# EAGLE board avocado_v2.0 (EAGLE 8.6.0)
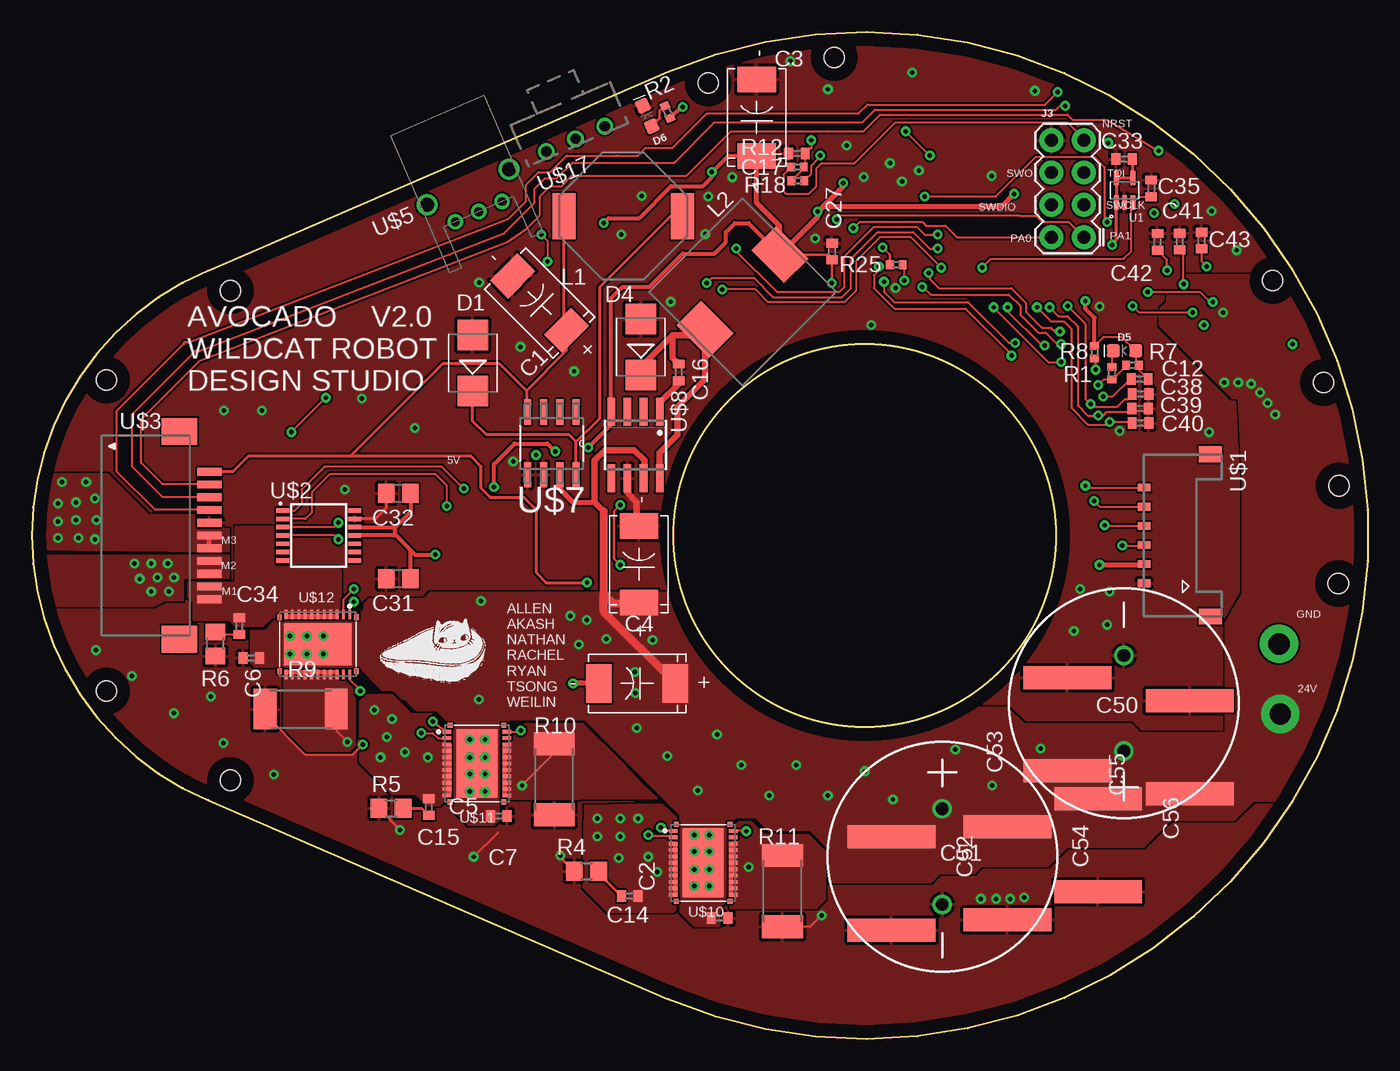
[diagram p2: board, top side]
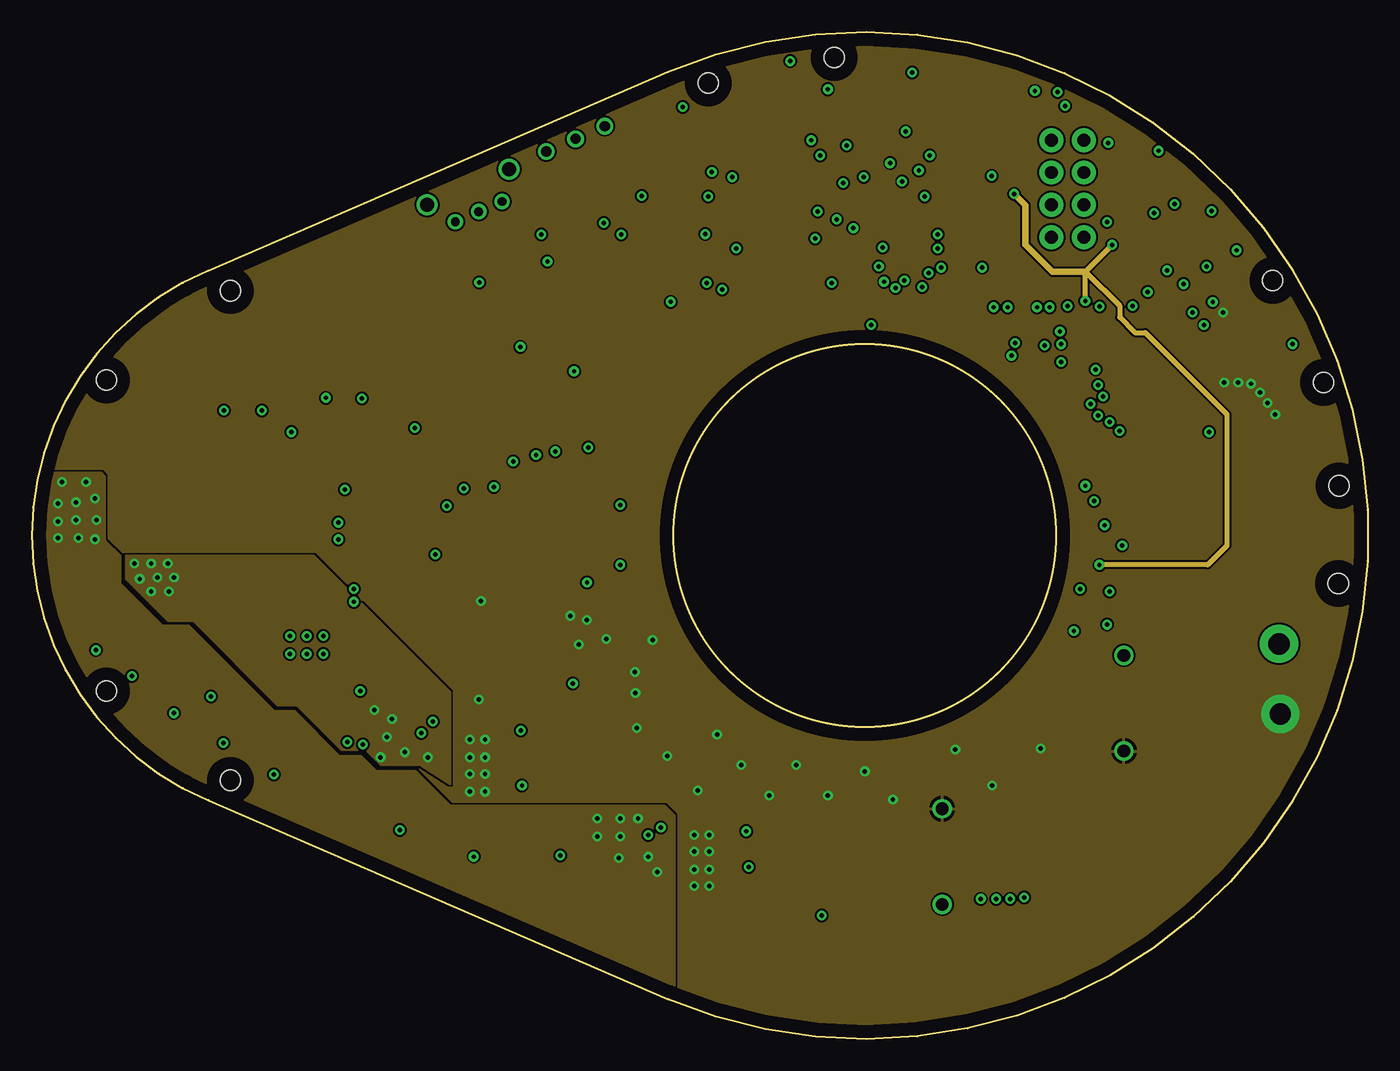
[diagram p3: board, inner layer Route2]
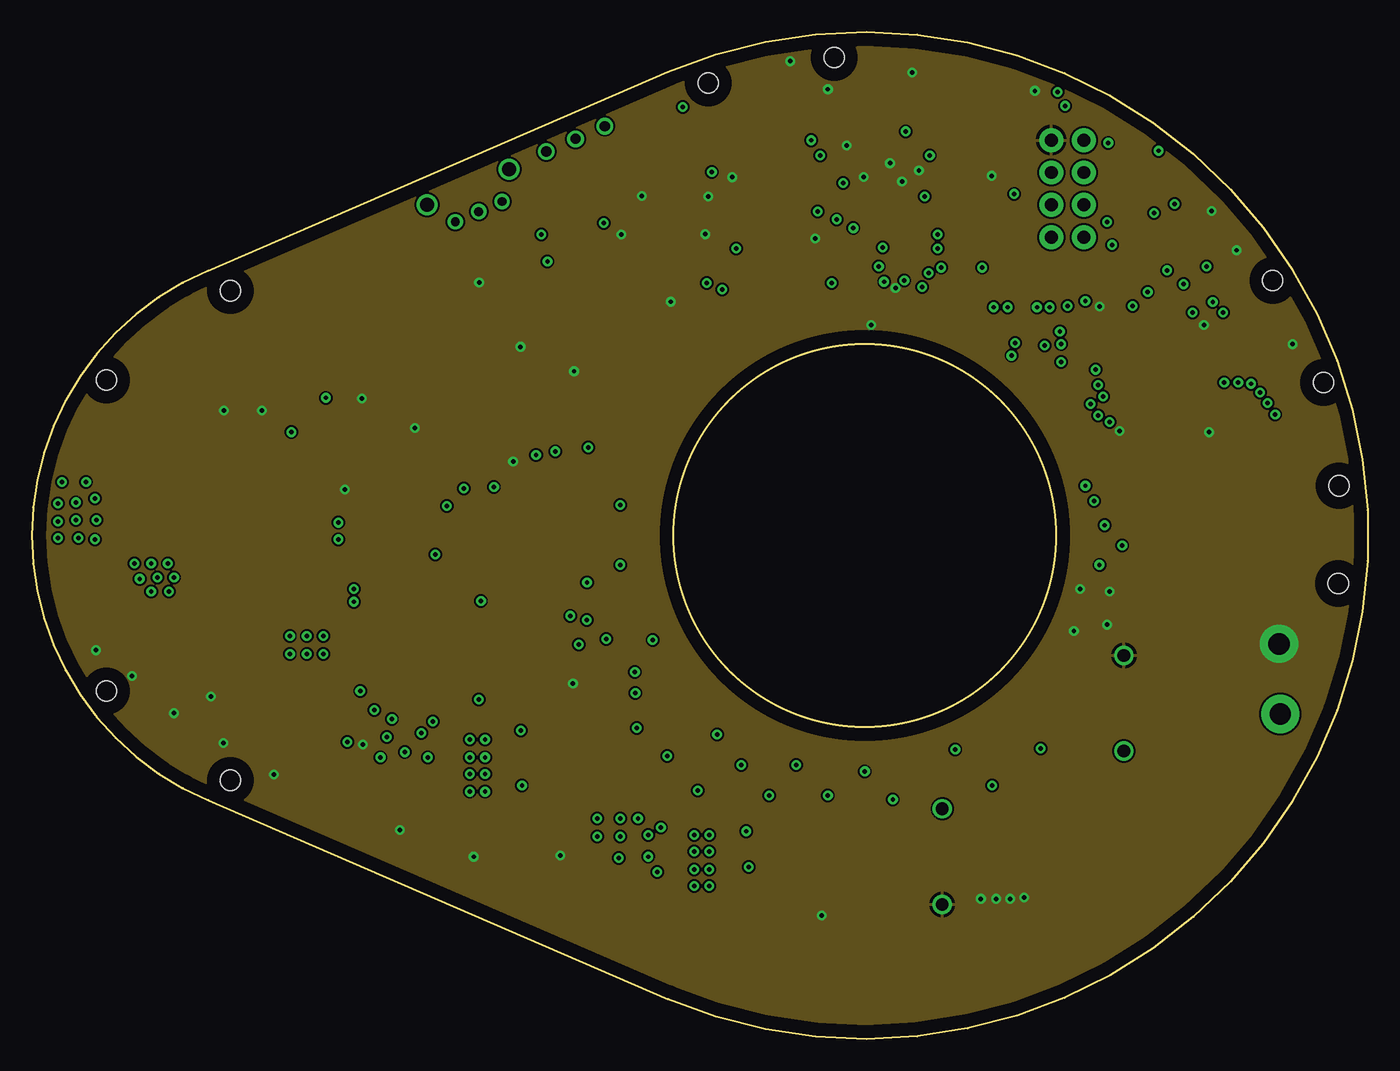
[diagram p4: board, inner layer Route15]
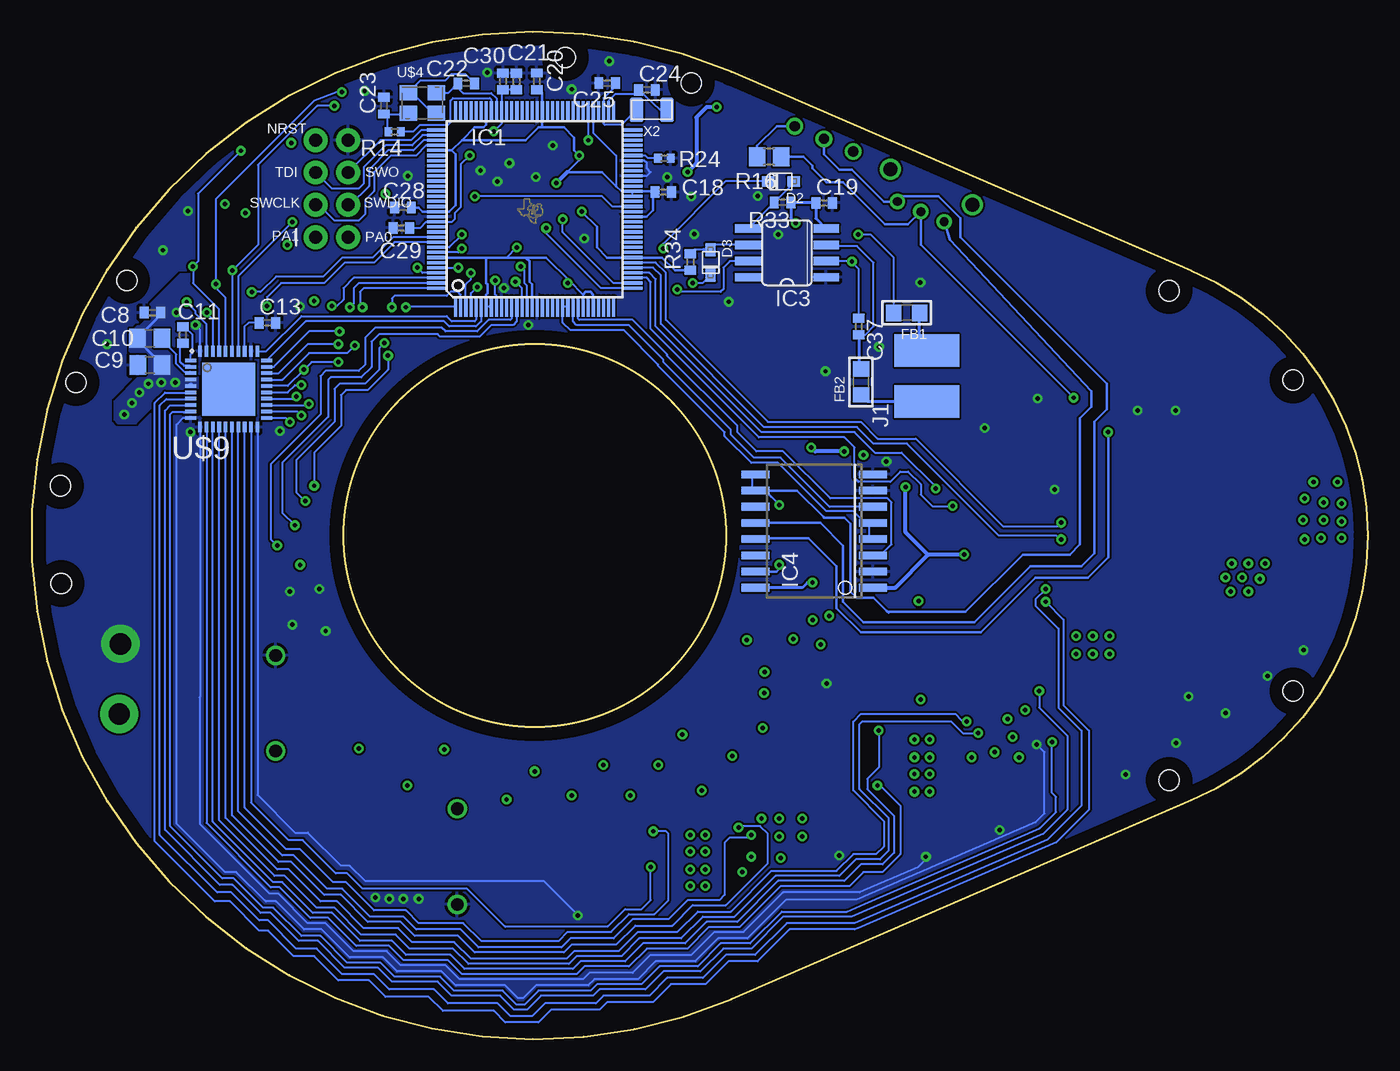
[diagram p5: board, bottom side, seen from below]

Size 104.81 x 79 mm. Coordinates in mm from the lower left corner, seen from the top.
Outline: 49.93,75.86 arc-226 49.93,3.14 13.84,18.73 arc-135 13.84,60.27 49.93,75.86
Outline: circle at 65.36,39.5 radius 15
Copper layers ((1*2)+(15*16)): Top 0.07mm / dielectric 0.36mm / Route2 0.0525mm / dielectric 0.71mm / Route15 0.0525mm / dielectric 0.36mm / Bottom 0.07mm
Design rules "default *": minimum track width 6mil, minimum drill 0.35mm, track to track 6mil, track to pad 6mil, pad to pad 6mil, via to via 6mil, smd to smd 6mil, copper to edge 40mil, drill to drill 6mil, minimum pad ring 10mil, minimum via ring 8mil, stop-mask expansion 4mil, vias tented up to drill 0mil, thermal gap 10mil
Holes 1.6 mm at 101.36,51.5 97.36,59.5 62.96,77 53.06,75 102.56,43.4 102.5,35.74 15.58,20.3 5.84,27.3 15.58,58.7 5.84,51.7

## Footprints (pad centres in the part's own frame; a part is rotated, then mirrored left to right if it is on the bottom)
2917-D = smd 2 x 3: + 3,0; - -3,0
C0402 = smd 0.7 x 0.9: 1 -0.65,0; 2 0.65,0
C0805 = smd 1.3 x 1.5: 1 -0.95,0; 2 0.95,0
UPJXXXXXMHD6 = drill 1: + -3.75,0; - 3.75,0
3025 = smd 1.8 x 6.9: P$1 -3.65,0; P$2 3.65,0
SMB = smd 2.4 x 2.4: A 2.2,0; C -2.2,0
SOD-323F = smd 1 x 0.8: A -1,0; C 1,0
LED-0603 = smd 1 x 1: A -0.877,0; C 0.877,0
_0805 = smd 1.2 x 1.3: 1 -1.016,0; 2 1.016,0
PDT_S-PQFP-G128 = smd 0.245 x 1.6: 1 -6.2,-7.65; 2 -5.8,-7.65; 3 -5.4,-7.65; 4 -5,-7.65; 5 -4.6,-7.65; 6 -4.2,-7.65; 7 -3.8,-7.65; 8 -3.4,-7.65; 9 -3,-7.65; 10 -2.6,-7.65; 11 -2.2,-7.65; 12 -1.8,-7.65; 13 -1.4,-7.65; 14 -1,-7.65; 15 -0.6,-7.65; 16 -0.2,-7.65; 17 0.2,-7.65; 18 0.6,-7.65; 19 1,-7.65; 20 1.4,-7.65; 21 1.8,-7.65; 22 2.2,-7.65; 23 2.6,-7.65; 24 3,-7.65; 25 3.4,-7.65; 26 3.8,-7.65; 27 4.2,-7.65; 28 4.6,-7.65; 29 5,-7.65; 30 5.4,-7.65; 31 5.8,-7.65; 32 6.2,-7.65; 65 6.2,7.65; 66 5.8,7.65; 67 5.4,7.65; 68 5,7.65; 69 4.6,7.65; 70 4.2,7.65; 71 3.8,7.65; 72 3.4,7.65; 73 3,7.65; 74 2.6,7.65; 75 2.2,7.65; 76 1.8,7.65; 77 1.4,7.65; 78 1,7.65; 79 0.6,7.65; 80 0.2,7.65; 81 -0.2,7.65; 82 -0.6,7.65; 83 -1,7.65; 84 -1.4,7.65; 85 -1.8,7.65; 86 -2.2,7.65; 87 -2.6,7.65; 88 -3,7.65; 89 -3.4,7.65; 90 -3.8,7.65; 91 -4.2,7.65; 92 -4.6,7.65; 93 -5,7.65; 94 -5.4,7.65; 95 -5.8,7.65; 96 -6.2,7.65 | smd 1.6 x 0.245: 33 7.65,-6.2; 34 7.65,-5.8; 35 7.65,-5.4; 36 7.65,-5; 37 7.65,-4.6; 38 7.65,-4.2; 39 7.65,-3.8; 40 7.65,-3.4; 41 7.65,-3; 42 7.65,-2.6; 43 7.65,-2.2; 44 7.65,-1.8; 45 7.65,-1.4; 46 7.65,-1; 47 7.65,-0.6; 48 7.65,-0.2; 49 7.65,0.2; 50 7.65,0.6; 51 7.65,1; 52 7.65,1.4; 53 7.65,1.8; 54 7.65,2.2; 55 7.65,2.6; 56 7.65,3; 57 7.65,3.4; 58 7.65,3.8; 59 7.65,4.2; 60 7.65,4.6; 61 7.65,5; 62 7.65,5.4; 63 7.65,5.8; 64 7.65,6.2; 97 -7.65,6.2; 98 -7.65,5.8; 99 -7.65,5.4; 100 -7.65,5; 101 -7.65,4.6; 102 -7.65,4.2; 103 -7.65,3.8; 104 -7.65,3.4; 105 -7.65,3; 106 -7.65,2.6; 107 -7.65,2.2; 108 -7.65,1.8; 109 -7.65,1.4; 110 -7.65,1; 111 -7.65,0.6; 112 -7.65,0.2; 113 -7.65,-0.2; 114 -7.65,-0.6; 115 -7.65,-1; 116 -7.65,-1.4; 117 -7.65,-1.8; 118 -7.65,-2.2; 119 -7.65,-2.6; 120 -7.65,-3; 121 -7.65,-3.4; 122 -7.65,-3.8; 123 -7.65,-4.2; 124 -7.65,-4.6; 125 -7.65,-5; 126 -7.65,-5.4; 127 -7.65,-5.8; 128 -7.65,-6.2
SO08 = smd 0.66 x 2.032: 1 -1.905,-3.073; 2 -0.635,-3.073; 3 0.635,-3.073; 4 1.905,-3.073; 5 1.905,3.073; 6 0.635,3.073; 7 -0.635,3.073; 8 -1.905,3.073
SOIC16 = smd 0.6 x 2.2: 1 -4.445,-4.6; 2 -3.175,-4.6; 3 -1.905,-4.6; 4 -0.635,-4.6; 5 0.635,-4.6; 6 1.905,-4.6; 7 3.175,-4.6; 8 4.445,-4.6; 9 4.445,4.6; 10 3.175,4.6; 11 1.905,4.6; 12 0.635,4.6; 13 -0.635,4.6; 14 -1.905,4.6; 15 -3.175,4.6; 16 -4.445,4.6
2_SMP = smd 2.54 x 5.08: 1 -2,0; 2 2,0
2X4 = drill 1.016 pad 1.88: 1 -3.81,-1.27; 2 -3.81,1.27; 3 -1.27,-1.27; 4 -1.27,1.27; 5 1.27,-1.27; 6 1.27,1.27; 7 3.81,-1.27; 8 3.81,1.27
SRU1028 = smd 1.8 x 3.6: 1 -4.65,0; 2 4.65,0
B82464G4473M000 = smd 2.7 x 3.6: 1 -4.15,0; 2 4.15,0
R0402 = smd 0.6 x 0.7: 1 -0.5,0; 2 0.5,0
R0805 = smd 1.3 x 1.5: 1 -0.95,0; 2 0.95,0
R2512 = smd 1.8 x 3.2: 1 -2.8,0; 2 2.8,0
R0402' = smd 0.7 x 0.9: 1 -0.65,0; 2 0.65,0
SOT65P210X110-5N = smd 1.19 x 0.4: 1 -0.96,0.65; 2 -0.96,0; 3 -0.96,-0.65; 4 0.96,-0.65; 5 0.96,0.65
5040500691 = smd 0.6 x 1: 1 3.75,0; 2 2.25,0; 3 0.75,0; 4 -0.75,0; 5 -2.25,0; 6 -3.75,0 | smd 1.25 x 1.8: P$7 6.355,5.19; P$8 -6.355,5.19
SOP65P640X120-14N = smd 1 x 0.35: 1 -2.825,1.95; 2 -2.825,1.3; 3 -2.825,0.65; 4 -2.825,0; 5 -2.825,-0.65; 6 -2.825,-1.3; 7 -2.825,-1.95; 8 2.825,-1.95; 9 2.825,-1.3; 10 2.825,-0.65; 11 2.825,0; 12 2.825,0.65; 13 2.825,1.3; 14 2.825,1.95
1MM-FPC-11PIN = smd 0.6 x 1.9: 1 -5,3.25; 2 -4,3.25; 3 -3,3.25; 4 -2,3.25; 5 -1,3.25; 6 0,3.25; 7 1,3.25; 8 2,3.25; 9 3,3.25; 10 4,3.25; 11 5,3.25 | smd 2.1 x 2.8: THERMPAD 8.15,0.9; THERMPAD1 -8.15,0.9
NX3225GA = smd 1.4 x 1.2: P$1 1.1,0.8; P$2 -1.1,0.8; P$3 -1.1,-0.8; P$4 1.1,-0.8
S03B-PASK-2 = drill 0.7: 1 2,0; 2 0,0; 3 -2,0 | drill 1.1: P$4 -3.5,2.1; P$5 3.5,2.1
SOIC127P620X175-8N = smd 1.981 x 0.559: 1 -2.464,1.905; 2 -2.464,0.635; 3 -2.464,-0.635; 4 -2.464,-1.905; 5 2.464,-1.905; 6 2.464,-0.635; 7 2.464,0.635; 8 2.464,1.905
SO08' = smd 0.6 x 2.2: 1 -1.905,-2.6; 2 -0.635,-2.6; 3 0.635,-2.6; 4 1.905,-2.6; 5 1.905,2.6; 6 0.635,2.6; 7 -0.635,2.6; 8 -1.905,2.6
DRV8323S = smd 0.28 x 0.85: AGND 1.75,2.975; CAL 2.25,2.975; DVDD 1.25,2.975; GHB -0.25,-2.975; GHC 0.25,-2.975; GLB -1.25,-2.975; GLC 1.25,-2.975; INHA 0.75,2.975; INHB -0.25,2.975; INHC -1.25,2.975; INLA 0.25,2.975; INLB -0.75,2.975; INLC -1.75,2.975; PGND -2.25,2.975; SHB -0.75,-2.975; SHC 0.75,-2.975; SNB -2.25,-2.975; SNC 2.25,-2.975; SPB -1.75,-2.975; SPC 1.75,-2.975 | smd 0.85 x 0.28: CPH -2.975,1.75; CPL -2.975,2.25; ENABLE 2.975,2.25; GHA -2.975,-0.25; GLA -2.975,-1.25; N_FAULT 2.975,-0.25; N_SCS 2.975,1.75; SCLK 2.975,1.25; SDI 2.975,0.75; SDO 2.975,0.25; SHA -2.975,-0.75; SNA -2.975,-2.25; SOA 2.975,-1.25; SOB 2.975,-1.75; SOC 2.975,-2.25; SPA -2.975,-1.75; VCP -2.975,1.25; VDRAIN -2.975,0.25; VM -2.975,0.75; VREF 2.975,-0.75 | smd 4.15 x 4.15: P$41 0,0
MOSFET_CSD88599Q5DC = smd 0.7 x 0.25: 1 -2.35,2.5; 2 -2.35,2; 3 -2.35,1.5; 4 -2.35,1; 5 -2.35,0.5; 6 -2.35,0; 7 -2.35,-0.5; 8 -2.35,-1; 9 -2.35,-1.5; 10 -2.35,-2; 11 -2.35,-2.5; 12 2.35,-2.5; 13 2.35,-2; 14 2.35,-1.5; 15 2.35,-1; 16 2.35,-0.5; 17 2.35,0; 18 2.35,0.5; 19 2.35,1; 20 2.35,1.5; 21 2.35,2; 22 2.35,2.5 | smd 0.43 x 0.375: 23 -2.115,3.013; 24 -2.115,-3.013; 25 2.115,-3.013; 26 2.115,3.013 | smd 3.3 x 5.4: 27 0,0
MHSS1105 = drill 0.8: 1 -2.5,0; 2 2.5,0; COM 0,0
ABRACON-ABS07-32.768KHZ = smd 1.1 x 1.9: P$1 -1.2,0; P$2 1.2,0

## Placement (x,y rotation side)
C1  100u  [2917-D]  39.84,57.73 315 top
C2  15u  [2917-D]  47.5,27.9 0 top
C3  100u  [2917-D]  56.87,72.28 270 top
C4  15u  [2917-D]  47.63,37.25 270 top
C5  10nF  [C0402]  36.64,17.49 0 top
C6  10nF  [C0402]  17.22,29.89 180 top
C7  10nF  [C0402]  53.96,9.49 0 top
C8  0.1uF  [C0402]  95.34,56.97 180 bottom
C9  10uF  [C0805]  95.55,52.87 180 bottom
C10  1uF  [C0805]  95.56,54.98 0 bottom
C11  0.047uF  [C0402]  92.97,55.23 90 bottom
C12  0.1uF  [C0402]  86.93,51.77 180 top
C13  1uF  [C0402]  86.34,56.18 0 bottom
C14  4.7nF  [C0402]  46.9,11.22 180 top
C15  4.7nF  [C0402]  31.14,18.19 270 top
C16  0.01uF  [C0402]  50.76,52.3 90 top
C17  0.1uF  [C0402]  60.03,69.47 180 top
C18  0.1uF  [C0402]  55.28,66.43 0 bottom
C19  10uF  [C0402]  42.64,65.58 0 bottom
C20  0.1uF  [C0402]  65.2,75.12 90 bottom
C21  0.1uF  [C0402]  66.79,75.11 90 bottom
C22  12pF  [C0402]  70.74,74.96 0 bottom
C23  12pF  [C0402]  77.18,73.21 90 bottom
C24  12pF  [C0402]  56.54,74.46 0 bottom
C25  12pF  [C0402]  59.68,74.97 180 bottom
C27  0.1uF  [C0402]  62.78,61.77 90 top
C28  0.1uF  [C0402]  75.68,65.22 180 bottom
C29  0.1uF  [C0402]  75.83,63.62 180 bottom
C30  2.2uF  [C0402]  67.84,75.12 90 bottom
C31  1uF  [C0805]  28.76,36.1 180 top
C32  1uF  [C0805]  28.76,42.8 180 top
C33  0.1uF  [C0402]  85.69,69.02 180 top
C34  4.7nF  [C0402]  16.29,32.38 270 top
C35  0.01uF  [C0402]  87.83,66.73 90 top
C37  0.01uF  [C0402]  39.93,55.89 270 bottom
C38  2200pF  [C0402]  86.98,50.59 0 top
C39  2200pF  [C0402]  86.95,49.45 0 top
C40  2200pF  [C0402]  86.98,48.31 0 top
C41  1000pF  [C0402]  90.06,62.55 90 top
C42  1000pF  [C0402]  88.32,62.54 90 top
C43  1000pF  [C0402]  91.77,62.63 90 top
C50  UPJXXXXXMHD6  [UPJXXXXXMHD6]  85.69,26.34 90 top
C51  UPJXXXXXMHD6  [UPJXXXXXMHD6]  71.43,14.31 270 top
C52  C7563  [3025]  67.46,12.2 270 top
C53  C7563  [3025]  81.26,24.7 90 top
C54  C7563  [3025]  76.56,13 270 top
C55  C7563  [3025]  90.86,22.9 90 top
C56  C7563  [3025]  83.66,15.2 270 top
D1  MBRS130LT3  [SMB]  34.59,53.03 90 top
D2  1n4148  [SOD-323F]  46.03,67.27 180 bottom
D3  1N4148  [SOD-323F]  51.56,60.91 270 bottom
D4  MBRS130LT3  [SMB]  47.78,54.27 90 top
D5  RED  [LED-0603]  85.73,53.99 180 top
D6  GREEN  [LED-0603]  48.29,72.4 113.4 top
FB1  Ferrite  [_0805]  36.17,56.96 180 bottom
FB2  Ferrite  [_0805]  39.75,51.55 90 bottom
IC1  TM4C129XXXPDT  [PDT_S-PQFP-G128]  65.36,65.1 0 bottom
IC3  MAX31855  [SO08]  45.56,61.66 90 bottom
IC4  ISO3088  [SOIC16]  43.42,39.84 90 bottom
J1  THERMOCOUPLE  [2_SMP]  34.59,51.99 90 bottom
J3  [2X4]  81.26,66.7 90 top
L1  SRU1028  [SRU1028]  46.39,64.55 180 top
L2  B82464G4473M000  [B82464G4473M000]  55.76,58.6 45 top
R1  330  [R0402]  84.74,52.22 270 top
R2  330  [R0402]  49.87,72.71 113.4 top
R4  2.21  [R0805]  43.51,13.16 0 top
R5  2.21  [R0805]  28.18,18.1 0 top
R6  2.21  [R0805]  14.4,30.99 90 top
R7  10K  [R0402]  86.36,52.85 0 top
R8  1.5K  [R0402]  83.38,53.87 90 top
R9  0.014  [R2512]  21.09,25.88 0 top
R10  0.014  [R2512]  41,20.38 90 top
R11  0.014  [R2512]  58.9,11.6 90 top
R12  10K  [R0402]  60.06,68.4 0 top
R14  2K  [R0402]  76.35,71.17 180 bottom
R16  120  [R0805]  46.96,69.2 180 bottom
R18  10K  [R0402]  60.1,67.33 0 top
R24  4.87K 1%  [R0402]  55.18,69.09 180 bottom
R25  [R0402]  67.83,60.74 180 top
R33  10K  [R0402']  45.91,65.63 180 bottom
R34  10K  [R0402']  53.14,60.95 90 bottom
U1  LMT87DCKT  [SOT65P210X110-5N]  85.74,66.58 90 top
U$1  5040500691  [5040500691]  87.26,39.5 270 top
U$2  AS5048A-HTSP-500  [SOP65P640X120-14N]  22.5,39.5 0 top
U$3  EC45FLAT_BLDC  [1MM-FPC-11PIN]  10.68,39.5 270 top
U$4  NX3225GA  [NX3225GA]  74.18,73.42 0 bottom
U$5  S03B-PASK-2  [S03B-PASK-2]  35.06,64.9 23.4 top
U$7  LM2594M-5.0  [SOIC127P620X175-8N]  40.79,46.72 270 top
U$8  LM2675M  [SO08']  47.36,46.6 180 top
U$9  DRV8323SHOMEMADE  [DRV8323S]  89.36,50.98 0 bottom
U$10  CSD88584Q5DC  [MOSFET_CSD88599Q5DC]  52.67,13.82 0 top
U$11  CSD88584Q5DC  [MOSFET_CSD88599Q5DC]  34.93,21.61 0 top
U$12  CSD88584Q5DC  [MOSFET_CSD88599Q5DC]  22.45,30.96 270 top
U$17  MHSS1105  [MHSS1105]  42.66,70.61 23.4 top
X2  [ABRACON-ABS07-32.768KHZ]  56.17,72.88 180 bottom

## Tracks (layer width: path | path; a pad name or v marks a point on that pad's centre or on a via)
3V3DC  (via drill 0.35)
  Top 0.152: C33.1 86.39,68.98 | v61.66,64.9 61.76,65 | C12.1 86.86,52.49 86.86,52.7 | 86.86,52.7 R7.2 | v61.86,69.3 61.16,68.5 61.16,67.89 R18.2 | R8.2 84.11,55.1 85.5,55.1 D5.A 86.61,52.95 86.86,52.7 | 28.41,40.15 28.46,40.1
  Top 0.203: R25.2 67.33,61.53 v66.76,62.1 | 62.56,60.9 C27.1 | C27.1 62.78,59.32 v62.77,59.31 | 59.66,61.53 62.37,61.53 C27.1
  Top 0.254: 86.39,68.98 U1.4 U1.5 U1.1 85.09,62.62 v84.76,62.3 | 45.53,48.27 45.53,48.5 45.53,49.07 | 61.5,65.06 v61.66,64.9 | 62.06,65.3 61.76,65 | 63.66,66.9 v63.66,67.14 | 87.21,37.2 U$1.2 | 28.56,39.5 28.36,39.5 28.46,39.6 | v53.36,68 53.36,67.6
  Top 0.305: v43.66,46.4 45.53,48.27 | v44.86,64 45.26,64.4 47.66,64.4 50.16,66.9 52.66,66.9 53.36,67.6 | R8.2 83.38,56.58 82.66,57.3 v82.66,57.9 | v41.06,46.1 40.46,46.7 37.86,46.7 36.26,45.1 v36.26,43.3 | C32.1 29.71,41.35 28.46,40.1 28.46,39.6 | U$2.12 28.41,40.15 | C31.1 29.71,38.35 | 29.71,38.35 28.56,39.5 | 28.36,39.5 U$2.11 | 29.71,38.35 30.06,38 v31.66,38 | R2.1 50.92,73.1 v51.06,73.1 | 45.53,48.5 45.53,49.13 U$8.4 45.46,58.09 46.36,59 48.46,59 51.06,61.6 53.56,61.6 54.46,62.5 54.46,63.3 55.16,64 56.23,64 L2.2 59.66,61.53 | v53.36,68 54.64,69.28 C3.+
  Top 0.406: v77.06,66.3 76.06,65.3 62.06,65.3 | 63.66,66.9 v61.66,64.9 61.66,64.5 L2.2 58.7,63.77 56.87,65.59 C3.+ | v83.76,37.2 87.21,37.2
  Route2 0.152: 77.26,66.5 v77.06,66.3
  Route2 0.406: 82.66,60.2 v84.76,62.3 | v82.66,57.9 82.66,60.2 | 82.66,60.2 85.36,57.5 85.36,56.6 86.56,55.4 87.36,55.4 93.76,49 93.76,38.7 92.26,37.2 v83.76,37.2
  Route2 0.508: v77.06,66.3 77.96,65.4 77.96,62.3 80.06,60.2 82.66,60.2
  Bottom 0.152: C20.1 64.76,74.24 | 73.03,64.92 IC1.113 | 38.39,35.54 39,35.54 IC4.1 38.39,35.54 | 38.39,35.54 38.26,35.41 38.26,35.51 | 57.59,61.29 IC1.39 | IC1.47 57.59,64.49 | 56.22,66.47 56.05,66.45 C18.1 | IC1.8 68.87,57.48 69.17,57.48 IC1.7 | 72.98,61.29 IC1.122 | 61.55,58.4 61.55,57.48 IC1.26 | IC1.69 60.76,71.1 58.96,69.3 58.96,66.9 58.56,66.5 IC1.52 | 66.06,61.3 66.07,61.29 | 43.36,46.1 v43.66,46.4 | 64.76,71.9 IC1.79 | IC1.52 IC1.51 | IC1.52 57.64,66.43 | 43.04,65.63 C19.1 | 69.06,59.2 69.16,59.3
  Bottom 0.2: 60.96,58.6 60.76,58.4 IC1.28
  Bottom 0.203: 64.76,74.24 IC1.79 64.76,71.5 | 71.86,69.7 71.56,69.4 71.56,65.4 72.06,64.9 IC1.113 74.16,64.9 74.48,65.22 C28.1 | IC1.101 71.86,69.7 | 71.86,69.7 71.06,70.5 | 71.06,70.5 70.06,71.5 69.36,71.5 69.16,71.7 IC1.90 | 69.17,57.48 69.17,58.4 69.06,58.51 69.06,59.2 | 62.62,59.46 61.55,58.4 61.35,58.6 60.96,58.6 | 62.62,59.46 v62.77,59.31 | IC1.16 65.56,59.2 65.76,59.4 65.76,61 66.06,61.3 64.45,61.3 62.62,59.46 | 67.57,61.29 69.16,61.29 | 69.16,61.29 72.98,61.29 | 66.07,61.29 67.57,61.29 | 58.96,66.9 60.06,68 62.8,68 61.86,68.94 v61.86,69.3 62.26,69.7 62.26,70.7 63.06,71.5 64.76,71.5 | 64.76,71.5 65.06,71.5 66.06,70.5 71.06,70.5 | v66.76,62.1 67.57,61.29 | R34.1 54.36,60.3 55.36,61.3 IC1.39 59.66,61.3 60.46,62.1 60.46,63.7 v61.66,64.9 | 69.16,59.3 69.16,61.29 | 57.59,64.49 56.57,64.49 56.05,65.01 56.05,66.31 | 56.05,66.31 56.05,66.45 | IC1.52 56,66.5 C18.1 56.05,66.31
  Bottom 0.254: 43.04,65.63 R33.1 45.26,64.4 v44.86,64 | IC4.1 38.56,35.4 38.56,35.26 | 34.46,38 34.49,37.98 | C19.1 43.29,64.37 IC3.4
  Bottom 0.305: v41.06,46.1 43.36,46.1 | 38.56,35.4 37.06,35.4 34.49,37.98 36.26,39.75 v36.26,43.3 | 62.8,68 v63.66,67.14 | v31.66,38 34.46,38 | v51.06,73.1 51.86,73.1 52.66,72.3 52.66,68.7 v53.36,68
5VDC  (via drill 0.35)
  Top 0.152: 42.35,65.86 L1.2 42.5,65.71 | 38.84,49.25 U$7.4
  Top 0.254: v43.56,35.8 40.36,35.8 39.56,36.6 39.56,41.5 38.56,42.5 35.96,42.5 35.26,43.2 35.26,44.9 34.46,45.7 24.96,45.7 | 38.84,49.25 38.8,49.3 38.8,50.86 | 24.96,45.7 16.96,45.7 15.76,44.5 U$3.1 | 24.96,45.7 32.26,53 36.66,53 38.8,50.86 | L1.2 41.74,56.23 C1.+ 41.96,54.03 38.8,50.86
  Bottom 0.254: v43.56,35.8 43.96,35.8 44.36,35.4 IC4.16
24VDC  (via drill 0.35, 1.68 pad 3)
  Top 0.152: 41.44,44.38 U$7.7 41.44,44.22 | 47.53,34.17 C4.+
  Top 0.305: 41.44,43.43 41.44,44.22
  Top 0.406: U$7.7 41.43,43.13 42.46,42.1 44.16,42.1 | 48.07,44.03 U$8.7
  Top 0.508: 44.86,41.4 44.16,42.1 44.16,45.4 44.96,46.2 47.26,46.2 48.07,45.4 48.07,44.03
  Top 0.61: 44.86,41.4 44.86,34.9 | 44.86,34.9 45.6,34.17 47.53,34.17 | C2.+ 44.86,33.53 44.86,34.9
  Bottom 0.152: 92.26,51.28 U$9.VDRAIN 92.41,51.28 | 94.39,52.81 C9.1 94.54,52.96 | 96.22,54.94 96.22,54.64 | 96.37,54.94 96.45,54.96 C10.1
  Bottom 0.254: C9.1 96.22,54.59 96.22,54.64 | C10.1 96.37,55.12 | 96.37,55.12 94.69,56.8 C8.1 | 96.37,55.12 96.37,55.1 | 96.37,55.1 96.37,54.94 | C10.1 96.49,54.98 96.37,55.1 | C10.1 96.46,54.98 96.45,54.96 | 96.37,54.94 96.47,54.94 C10.1 | 96.37,54.94 96.22,54.94
  Bottom 0.305: 92.34,51.35 92.41,51.28
  other vias: 35.56,19.4 35.56,20.8 35.56,22.1 34.36,19.4 34.36,20.8 34.36,22.1 51.96,13.3 51.96,14.7 51.96,16 53.16,13.3 53.16,14.7 93.56,51.5 94.66,51.5 95.66,51.4 96.36,50.7 96.96,49.9 97.56,49 93.46,57 53.16,16 34.36,23.5 35.56,23.5 51.96,12 53.16,12 20.26,31.6 20.26,30.2 21.56,30.2 22.86,30.2 22.86,31.6 21.56,31.6 97.96,25.5 49.86,22.2 53.76,23.9 52.26,19.5 55.66,21.5 57.86,19.1 59.96,21.5 62.46,19.1 65.36,21 67.56,18.8 72.46,22.7 75.36,19.9 79.16,22.8 35.06,26.62 35.24,34.36 43.54,32.86 45.06,31.38 42.92,30.96 47.32,28.78 47.36,27.14 47.46,24.4 48.7,31.3 42.24,33.2
  pour Route2 (rank 3): -4.14,82.4 -4.14,-1.6 113.26,-1.5 113.36,-1.6 113.36,82.5
  pour Bottom (no thermals): 89.26,60 93.16,60 95.66,57.5 95.66,56.6 96.36,55.9 96.56,55.9 97.16,55.3 97.16,54 96.46,53.3 96.46,51.9 98.36,50 98.36,48.6 98.06,48.3 96.66,48.3 94.26,50.7 92.06,50.7 91.76,51 91.76,52.1 91.86,52.2 91.86,54.1 91.66,54.3 90.56,54.3 90.46,54.2 88.46,56.2 88.46,57.2 89.06,57.8 89.06,59.8
  pour Top (no thermals): 89.16,59.9 89.06,59.8 89.06,57.8 88.46,57.2 88.46,56 94.16,50.3 94.66,50.3 94.96,44.2 94.96,34.9 93.66,32.6 93.66,24 95.36,22.3 107.26,22.3 107.26,52.6 99.96,59.9
  pour Top (rank 2, no thermals): 101.86,24 86.96,24 86.26,24.7 77.86,24.7 76.56,26 59.96,26 50.96,35 31.26,35 30.76,34.5 26.46,34.5 26.06,34.1 26.06,33.7 25.66,33.3 24.66,33.3 24.16,32.8 19.06,32.8 18.56,32.3 18.56,32.2 18.36,32 17.16,32 17.16,29.5 17.46,29.2 25.66,29.2 27.46,27.4 28.36,27.4 29.06,26.7 29.26,26.7 30.16,25.8 31.76,25.8 33.06,24.5 33.06,18 34.26,16.8 36.26,16.8 36.66,17.2 36.66,24.2 37.56,25.1 43.36,25.1 50.86,17.6 50.86,10 51.96,8.9 53.96,8.9 53.96,10 54.06,10.1 54.06,10.4 54.46,10.8 54.46,16.6 55.26,17.4 56.76,17.4 57.76,16.4 61.06,16.4 62.56,14.9 62.56,12.3 70.56,12.3 71.26,13 73.96,13 74.56,13.6 79.76,13.6 81.26,15.1 87.26,15.1 89.36,17.2 94.36,17.2 95.86,18.7 101.26,18.7 101.86,19.3
A
  Bottom 0.152: 47.68,40.41 48.29,40.41 48.15,40.45 IC4.12 43.26,40.48
  Bottom 0.203: 48.15,40.45 48.12,40.48 43.26,40.48 42.94,40.48 41.16,38.7 41.16,34.3 39.56,32.7 30.86,32.7 26.46,37.1 22.46,37.1 21.46,38.1 21.46,48.4 20.46,49.4 20.46,51.4 31.96,62.9 31.96,64.4 33.66,66.1 36.49,66.1 U$5.1 37.96,65.69 40.46,68.2 41.46,68.2 42.66,69.4 U$17.COM
B  (via drill 0.35)
  Top 0.203: v20.36,47.6 v23.06,50.3
  Bottom 0.152: 48.16,39.2 IC4.13
  Bottom 0.203: 48.16,39.2 48.06,39.3 43.86,39.3 41.66,37.1 41.66,33.8 39.76,31.9 30.36,31.9 26.06,36.2 21.96,36.2 20.36,37.8 v20.36,47.6 | v23.06,50.3 35.06,62.3 U$5.2 36.06,63.9 37.86,63.9 41.16,67.2 42.46,67.2 43.56,68.3 43.56,68.5 44.26,69.2 R16.1
CS
  Bottom 0.152: IC3.6 51.18,62.3 D3.A 52.82,61.91 R34.2
  Bottom 0.254: D3.A 52.12,61.91
DVDD
  Bottom 0.152: U$9.DVDD 88.14,54.03 88.14,55.86 87.82,56.18 C13.1
GH1  (via drill 0.35)
  Top 0.152: U$12.1 24.95,33.98 v25.26,34.3
  Bottom 0.152: U$9.GHA 92.37,50.7 94.36,50.7 95.16,49.9 95.16,15.5 90.46,10.8 89.26,10.8 86.96,8.5 86.26,8.5 84.26,6.5 82.66,6.5 80.76,4.6 78.36,4.6 77.06,3.3 73.66,3.3 72.56,2.2 68.56,2.2 67.66,1.3 65.06,1.3 64.06,2.3 60.26,2.3 59.66,2.9 56.06,2.9 54.66,4.3 51.96,4.3 50.16,6.1 47.86,6.1 45.36,8.6 40.24,8.6 40.01,8.7 24.43,15.43 21.86,18 21.86,24.2 23.86,26.2 23.86,32.9 v25.26,34.3
GH2  (via drill 0.35)
  Top 0.152: v31.46,24.9 32.55,24.11 U$11.1
  Bottom 0.152: U$9.GHB 89.61,17.35 85.56,13.3 84.66,13.3 82.16,10.8 80.86,10.8 78.76,8.7 76.06,8.7 74.96,7.6 71.66,7.6 70.36,6.3 62.86,6.3 62.26,6.9 58.76,6.9 57.26,8.4 54.16,8.4 52.56,10 49.96,10 46.76,13.2 41.66,13.2 40.36,14.5 38.56,14.5 37.96,15.1 37.96,17.1 40.36,19.5 40.36,24.9 39.76,25.5 32.36,25.5 31.86,25 v31.46,24.9
GH3  (via drill 0.35)
  Top 0.152: U$10.1 49.64,16.32 v49.36,16.6
  Bottom 0.152: U$9.GHC 89.11,17.55 85.46,13.9 84.46,13.9 81.86,11.3 80.56,11.3 78.46,9.2 75.86,9.2 74.76,8.1 71.36,8.1 70.06,6.8 63.06,6.8 62.46,7.4 58.96,7.4 57.46,8.9 54.56,8.9 52.96,10.5 50.36,10.5 47.06,13.8 47.06,16.1 47.66,16.7 49.26,16.7 v49.36,16.6
GL1  (via drill 0.35)
  Top 0.152: U$12.22 24.95,28.18 25.66,27.47 25.66,27.4 v25.76,27.3
  Bottom 0.152: U$9.GLA 92.37,49.7 93.96,49.7 94.36,49.3 94.36,16.4 90.06,12.1 89.06,12.1 86.86,9.9 86.06,9.9 83.86,7.7 82.36,7.7 80.26,5.6 77.66,5.6 76.56,4.5 72.96,4.5 71.86,3.4 68.06,3.4 66.96,2.3 65.96,2.3 64.86,3.4 60.76,3.4 60.26,3.9 56.66,3.9 55.26,5.3 52.36,5.3 50.56,7.1 48.36,7.1 45.86,9.6 40.51,9.6 25.46,16.1 23.56,18 23.56,23.8 25.76,26 v25.76,27.3
GL2  (via drill 0.35)
  Top 0.152: v38.36,24.2 38.27,24.11 U$11.22
  Bottom 0.152: U$9.GLB 90.61,17.05 85.86,12.3 85.16,12.3 82.76,9.9 81.26,9.9 79.06,7.7 76.56,7.7 75.46,6.6 71.96,6.6 70.86,5.5 62.36,5.5 61.76,6.1 58.26,6.1 56.86,7.5 53.56,7.5 51.86,9.2 49.46,9.2 46.26,12.4 41.06,12.4 39.76,13.7 38.06,13.7 37.16,14.6 37.16,17.5 39.26,19.6 39.26,20.4 38.36,21.3 v38.36,24.2
GL3  (via drill 0.35)
  Top 0.152: v56.06,16.3 56.04,16.32 U$10.22
  Bottom 0.152: U$9.GLC 88.11,18.15 84.86,14.9 83.76,14.9 81.16,12.3 80.16,12.3 77.96,10.1 75.46,10.1 74.46,9.1 70.96,9.1 69.56,7.7 63.46,7.7 62.76,8.4 59.36,8.4 57.96,9.8 55.96,9.8 54.86,10.9 54.86,16.1 55.06,16.3 v56.06,16.3
GND  (via drill 0.35, 1.68 pad 3)
  Top 0.152: 25.83,23.23 v25.96,23.1 25.16,22.3 21.46,22.3 18.29,25.47 R9.1 | v34.66,14.3 36.56,16.2 | v61.96,9.7 61.06,8.8 R11.1
  Top 0.254: R5.1 28.86,16.46 v28.86,16.4 | R4.1 41.46,14.26 v41.46,14.4 | C32.2 27.81,41.65 26.96,40.8 U$2.13
  Top 0.406: C2.- v42.47,27.9 v42.46,27.9 | U$8.6 46.83,43.13 | 47.46,40.8 47.36,40.7 47.36,40.51 C4.-
  Top 0.508: U$8.6 46.73,42.83 47.46,42.1 47.46,40.8
  Bottom 0.152: C24.2 55.91,74.4 55.91,74.38 | IC1.55 56.56,67.7 56.26,68 56.56,68.3 56.56,68.7 56.76,68.9 IC1.58 | U$9.SNB 91.61,26.85 | 91.61,26.85 91.66,26.8 | U$9.SNA 92.93,48.73 93.46,48.2 93.46,16.9 89.66,13.1 88.76,13.1 86.46,10.8 85.66,10.8 83.46,8.6 82.06,8.6 79.86,6.4 77.26,6.4 76.16,5.3 72.66,5.3 71.56,4.2 67.66,4.2 66.66,3.2 66.26,3.2 65.26,4.2 61.16,4.2 60.66,4.7 57.26,4.7 55.86,6.1 52.76,6.1 50.96,7.9 48.66,7.9 45.63,10.93 40.11,10.93 26.06,17 25.36,17.7 25.36,22.5 v25.96,23.1 | 91.61,26.85 91.61,16.85 86.16,11.4 85.46,11.4 83.16,9.1 81.76,9.1 79.56,6.9 76.96,6.9 75.86,5.8 72.36,5.8 71.26,4.7 61.56,4.7 61.06,5.2 57.66,5.2 56.26,6.6 53.06,6.6 51.26,8.4 48.96,8.4 45.86,11.5 39.86,11.5 35.28,13.48 34.66,14.1 v34.66,14.3 | U$9.SNC 87.11,19.15 84.16,16.2 83.16,16.2 80.56,13.6 79.86,13.6 78.66,12.4 64.66,12.4 v61.96,9.7 | U$9.PGND 91.61,55.65 v91.96,56
  Bottom 0.406: v42.46,27.9 42.56,27.9
  other vias: 92.36,47.6 46.26,63.1 62.46,74.5 69.06,75.8 65.86,56 85.36,47.7 54.96,67.6 65.26,67.62 67.33,68.7 68.27,67.27 69.6,68.14 63.94,70.08 59.51,76.7 52.83,63.13 35.09,59.33 75.31,67.71 94.52,61.87 92.56,64.94 83.77,57.45 67.76,58.9 37.76,45.3 74.46,11 75.66,11 76.76,11 77.86,11.1 24.56,43.1 97.86,31 42.54,52.38 38.34,54.3 30.06,47.94 25.88,50.24 47.86,66.14 78.7,74.38 98.92,54.5 5.04,30.5 7.86,28.48 11.14,25.56 14.06,26.86 15.04,23.22 19,20.76 15.06,49.3 18.06,49.3 61.46,62.8 53.06,66.1 50.13,57.83 81.76,32 84.36,32.5 84.56,35.1 82.26,35.3
  pour Top (rank 3): -3.54,82.5 113.36,82.5 113.36,-1.5 -3.54,-1.5
  pour Bottom (rank 3): -4.84,82.5 113.36,82.5 113.36,-1.5 -4.84,-1.5
  pour Route15 (rank 3): -4.44,82.5 113.36,82.5 113.36,-1.5 -4.44,-1.5
  pour Top (no thermals): 84.66,27.8 78.36,27.8 77.86,28.3
GND_EXT  (via drill 0.35)
  Top 0.152: 45.66,37.7 45.71,37.65
  Top 0.203: v46.16,41.9 45.66,41.4 45.66,37.7 | 45.71,37.65 v46.16,37.2
  Bottom 0.152: IC4.9 48.29,44.22 48.29,43.16 IC4.10 48.29,43 47.86,43 47.27,43 | 48.11,36.6 48.29,36.6 IC4.15 | 48.11,36.6 47.76,36.6 | 47.76,36.6 47.68,36.6 | 44.86,43 47.27,43 | 42.66,40.9 42.71,40.95 | 47.8,36.64 47.76,36.6 | 48.72,36.64 48.15,36.64 48.11,36.6 | 46.39,36.67 46.46,36.67 | v46.16,41.9 47.27,43 | 37.76,33.6 37.56,33.4
  Bottom 0.203: 42.66,40.9 41.06,40.9 40.56,40.4 40.56,35.1 40.06,34.6 38.76,34.6 37.76,33.6 37.66,33.5 31.56,33.5 27.06,38 23.36,38 22.56,38.8 22.56,48.7 21.66,49.6 21.66,50.8 32.77,62.71 U$5.3 33.21,64.09 33.21,64.05 | 42.71,40.95 44.77,43 44.86,43 47.86,43 | IC4.10 47.28,43.02 v46.16,41.9 | v46.16,37.2 46.16,36.9 46.39,36.67 | 46.46,36.67 IC4.15
H1  (via drill 0.35)
  Top 0.152: U$3.3 10.26,42.5 7.86,44.9 7.86,49 12.81,53.95 | 12.81,53.95 12.86,54 | v89.06,60.3 89.06,61.14 C42.1 | v81.06,73.2 80.66,73.2 80.36,72.9 66.16,72.9 65.16,71.9 53.56,71.9 50.41,68.75 42.41,68.75 41.16,67.5 40.26,67.5 39.46,66.7 39.46,65.6 37.06,63.2 13.09,53.95 12.81,53.95
  Bottom 0.152: 89.21,54.03 U$9.INLA 89.11,60.25 v89.06,60.3 87.06,62.3 87.06,68.56 82.42,73.2 v81.06,73.2
H2  (via drill 0.35)
  Top 0.152: U$3.4 9.66,41.5 6.66,44.5 6.66,49.3 11.86,54.5 | v80.48,74.28 79.5,73.3 65.56,73.3 64.86,72.6 52.96,72.6 50.26,69.9 48.16,69.9 47.56,69.3 45.96,69.3 45.86,69.3 41.96,69.3 40.66,68 39.76,68 38.76,67 38.76,65.7 37.39,64.33 12.3,54.64 | v90.36,59.21 90.36,61.59 C41.1
  Top 0.2: 12.37,54.72 12.3,54.64 12.01,54.64 11.86,54.5
  Bottom 0.152: U$9.INHB 89.61,58.15 90.36,58.9 v90.36,59.21 90.36,65.9 82.66,73.6 80.92,74.28 v80.48,74.28
H3  (via drill 0.35)
  Top 0.152: C43.1 91.77,61 v92.16,60.6 | U$3.2 10.26,43.5 8.56,45.2 8.56,48.6 13.16,53.2 37.26,62.5 37.56,62.7 38.86,63.6 39.86,64.6 39.86,66.1 40.66,66.9 41.56,66.9 42.36,67.7 51.36,67.7 54.86,71.2 65.26,71.2 66.56,72.5 81.26,72.5 81.66,72.1 84.37,72.1 v88.4,69.67
  Bottom 0.152: U$9.INLB 90.12,54.03 90.16,54.07 90.16,57.3 92.16,59.3 v92.16,60.6 91.76,61 91.76,66.31 v88.4,69.67
ISENS1  (via drill 0.35)
  Top 0.152: U$12.19 U$12.18 | R9.2 23.89,24.17 v24.76,23.3
  Bottom 0.152: 92.91,49.15 92.41,49.15 U$9.SPA 92.37,49.2 93.76,49.2 93.96,49 93.96,16.7 89.86,12.6 88.96,12.6 86.66,10.3 85.86,10.3 83.66,8.1 82.16,8.1 80.06,6 77.46,6 76.36,4.9 72.76,4.9 71.66,3.8 67.86,3.8 66.76,2.7 66.16,2.7 65.06,3.8 60.96,3.8 60.46,4.3 56.96,4.3 55.56,5.7 52.56,5.7 50.76,7.5 48.46,7.5 45.96,10 40.85,10 39.46,10.6 25.73,16.53 24.46,17.8 24.46,19 24.76,19.3 v24.76,23.3
  pour Top (no thermals): 19.76,24.4 21.56,22.6 24.96,22.6 25.36,23 25.36,26.7 25.16,26.9 25.16,27.5 24.66,28 24.06,28 24.06,28.9 19.76,28.9
ISENS2  (via drill 0.35)
  Top 0.152: v38.46,19.9 41,22.44 R10.2
  Top 0.254: U$11.20 U$11.19
  Bottom 0.152: 91.16,47.95 U$9.SPB 91.11,16.95 86.06,11.9 85.36,11.9 82.96,9.5 81.56,9.5 79.36,7.3 76.76,7.3 75.66,6.2 72.16,6.2 71.06,5.1 62.06,5.1 61.46,5.7 57.96,5.7 56.56,7.1 53.36,7.1 51.66,8.8 49.26,8.8 46.06,12 40.66,12 39.56,13.1 38.06,13.1 36.66,14.5 36.66,18.3 38.26,19.9 v38.46,19.9
  pour Top (no thermals): 36.96,23.1 37.06,18.8 49.06,18.9 47.86,20 46.26,21.7 43.26,24.7 37.66,24.7 37.06,24.1 37.06,18.9
ISENS3  (via drill 0.35)
  Top 0.152: 56.33,13.5 v56.26,13.5
  Top 0.305: U$10.15 U$10.16 U$10.17 U$10.18 U$10.19 U$10.20
  Bottom 0.152: 67.66,8.8 67.71,8.85 | 67.71,8.85 70.66,11.8 78.86,11.8 80.06,13 80.96,13 83.56,15.6 84.66,15.6 87.61,18.55 U$9.SPC | 67.71,8.85 59.61,8.85 58.26,10.2 56.96,10.2 56.26,10.9 v56.26,13.5
  pour Top (no thermals): 54.76,10.3 61.56,10.3 62.26,11 62.26,14.7 60.96,16 57.46,16 56.46,17 55.46,17 54.76,16.3
M1
  pour Top (no thermals): 15.96,35.8 12.26,35.8 12.26,34.7 12.66,34.3 12.66,32.9 15.46,32.9 15.96,32.4 18.16,32.4 18.86,33.1 23.96,33.1 24.26,33.4 24.26,36.8 24.06,37 19.16,37 18.96,37.2 18.96,40.2 15.96,40.2
M2  (via drill 0.35)
  other vias: 26.86,25.8 28.26,25.1 27.86,23.7 27.36,22.1 29.26,22.5 31.06,22.1 8.06,37.3 8.46,36.1 9.36,37.3 9.86,36.2 10.66,37.3 11.16,36.2 9.36,35.1 10.76,35.1
  pour Top (no thermals): 32.66,19 31.96,18.3 31.16,18.3 30.76,18.7 30.66,18.7 30.16,19.2 28.26,19.2 25.76,21.7 25.76,26.5 26.26,27 28.26,27 29.76,25.5 31.36,25.5 32.66,24.2
  pour Top (no thermals): 11.96,36.2 15.46,36.2 15.46,37.9 -0.84,37.9 -0.84,34.1 -0.74,34 9.56,34 10.46,34.4 11.86,34.4 11.86,35.9
  pour Route2 (no thermals): 7.36,37.9 7.36,36.1 10.66,32.8 12.66,32.8 19.26,26.2 20.76,26.2 24.26,22.7 25.96,22.7 26.06,22.8 27.36,21.5 30.46,21.5 32.86,20 32.86,27.2 22.16,37.9
M3  (via drill 0.35)
  Top 0.406: U$3.7 U$3.6
  other vias: 44.36,17.3 46.16,17.3 47.56,17.3 44.36,15.9 46.16,15.9 46.06,14.2 48.36,14.3 49.06,13.1 2.36,43.7 2.06,42 2.06,40.6 2.06,39.3 3.66,39.3 4.96,39.2 5.06,40.7 3.46,40.7 3.46,42.1 4.96,42.4 4.26,43.7
  pour Top (no thermals): 50.56,17.4 49.46,18.4 43.36,18.3 43.26,11.9 45.16,10 50.36,10 50.56,10.2
  pour Top (no thermals): 10.86,38.3 15.46,38.3 15.46,40 12.76,40 12.76,41.1 9.16,41.1 5.96,44.3 -0.74,44.3 -0.84,44.2 -0.84,40.3 -0.94,38.4 -0.44,38.4
  pour Route2 (no thermals): 49.66,18.3 32.86,18.3 30.16,21 27.06,21 25.86,22.2 24.16,22.2 20.66,25.7 19.06,25.7 12.36,32.4 10.26,32.4 6.96,35.7 6.96,37.9 5.76,39.1 5.76,44.1 5.46,44.4 -1.44,44.4 -1.94,43.9 -1.94,25.6 20.66,3 50.46,3 50.46,17.5
N$1
  Top 0.152: C34.2 14.61,31.73 R6.2
N$2
  Bottom 0.152: U$9.VCP 92.41,52.35 92.87,52.35 93.48,52.96 93.48,53.71 94.39,54.63 94.39,54.94 C10.2
N$3
  Bottom 0.152: U$9.CPH 92.41,52.81 92.87,52.81 93.16,53.1 93.16,54.39 C11.1 92.71,54.48
N$4
  Top 0.508: C16.1 50.76,51.4 49.27,49.9 U$8.1
N$5  (via drill 0.35)
  other vias: 89.66,65.5
N$6
  Bottom 0.152: 92.64,55.88 92.76,55.88 | 92.76,55.88 C11.2 | U$9.CPL 92.34,53.72 92.21,53.85 | 92.21,53.85 92.16,53.9 | 92.21,53.85 92.21,55.25 92.76,55.8 92.76,55.88
N$7
  Top 0.203: 49.26,72.22 49.26,72.8 49.63,73.17 R2.2
  Top 0.254: D6.A 49.26,72.22
N$8
  Top 0.152: 84.84,54.08 D5.C 84.74,53.88 R1.1 84.96,52.83
N$10  (via drill 0.35)
  other vias: 88.06,64.8
N$11  (via drill 0.35)
  other vias: 84.46,70.3
N$13
  Bottom 0.254: J1.2 35.15,54.56 FB1.1
N$15  (via drill 0.35)
  Top 0.152: v39.96,63.1 40.46,62.6 v40.46,61
  Bottom 0.152: FB1.2 37.18,61.3 | 37.18,61.3 37.18,61.32 | v40.46,61 40.56,61 | 40.56,61 42.46,61 | 40.56,61 39.93,60.37 C37.1 | 37.18,61.3 38.98,63.1 v39.96,63.1
  Bottom 0.254: FB1.2 37.6,56.54 | 41.66,61.1 41.74,61.03 IC3.2 42.46,61
N$16
  Bottom 0.254: J1.1 39.22,49.99 FB2.1
N$17
  Bottom 0.152: C37.2 39.42,55.24 38.76,55.9 38.76,60.9 40.06,62.2 42.38,62.2 IC3.3
  Bottom 0.254: C37.2 39.93,52.74 FB2.2 | IC3.3
N$18  (via drill 0.35)
  other vias: 39.56,45.8
N$22  (via drill 0.35)
  Top 0.152: v84.06,50.4 84.81,50.4 86.18,51.77 C12.2
  Bottom 0.152: U$9.VREF 84.23,50.23 v84.06,50.4
N$23
  Bottom 0.203: R16.2 47.91,70.05 46.36,71.6 U$17.2
N$24
  Top 0.152: 51.04,65.71 51.65,65.71 L1.1 | U$7.8 42.81,44.38 U$7.8
  Top 0.254: D1.C 34.59,48.47 35.66,47.4 42.13,47.4 42.7,46.84 | 51.04,64.38 L1.1 50.11,64.55 44.56,59 44.56,48.7 42.7,46.84 | U$7.8 42.7,46.84
N$25
  Top 0.508: U$8.8 49.27,46 50.66,47.4 50.66,49.6 52.83,51.77 L2.1 52.36,55.2 50.26,55.2 | 50.26,55.2 47.78,52.72 D4.C | 50.26,55.2 50.26,53.45 C16.2
N$40
  Top 0.152: R4.2 44.46,13.01
  Top 0.254: 44.46,13.01 C14.2
N$41
  Top 0.254: R5.2 30.59,18.09 C15.2
N$42
  Bottom 0.152: 73.14,72.42 U$4.P$4 | 73.68,72.62 U$4.P$4 | U$4.P$4 73.38,72.62 74.98,74.22 U$4.P$2 74.3,75.2 72.36,75.2 71.86,75.7 70.83,75.7 C22.2
N$45
  Bottom 0.152: 77.05,72.42 77.14,72.52 | 77.14,72.52 C23.1 76.94,72.57 76.94,71.2 R14.2 | U$4.P$3 75.38,72.52 77.14,72.52
NFAULT  (via drill 0.35)
  Top 0.152: R7.1 85.96,52.84 R1.2 84.08,51.72 v83.66,51.3
  Bottom 0.152: U$9.N_FAULT 84.73,50.73 84.16,51.3 v83.66,51.3
NRST  (via drill 0.35)
  Top 0.152: 61.16,69.95 61.16,69.85 | 59.5,67.37 R18.1 60.53,68.26 60.53,68.4 R12.2 60.68,68.52 C17.1 61.16,69.95 | 61.16,69.95 v61.16,70.5
  Bottom 0.152: IC1.70 v61.16,70.5
NTRST
  Top 0.152: J3.7 82.53,70.63 81.26,71.9 67.76,71.9 64.56,68.7 61.96,68.7 61.56,68.3 61.56,66.9 60.96,66.3 59.16,66.3 58.96,66.5 58.96,67.8 R12.1
NWAKE
  Bottom 0.152: IC1.64 58.46,71.3
OSC0
  Bottom 0.152: IC1.88 68.36,73.8 68.76,74.2 70.96,74.2 71.39,74.63 C22.1 72.13,74.22 U$4.P$1
OSC1
  Bottom 0.152: R14.1 74.89,71.17 74.36,71.7 72.16,71.7 71.96,71.9 71.96,73.6 71.76,73.8 68.86,73.8 68.76,73.7 IC1.89
PA0  (via drill 0.35)
  Top 0.152: J3.2 72.57,62.89 71.66,63.8 70.16,63.8 69.86,64.1 64.96,64.1 v64.46,63.6
  Bottom 0.152: IC1.33 60.16,58.9 64.46,63.2 v64.46,63.6
PA1  (via drill 0.35)
  Top 0.152: J3.1 81.32,64.1 79.26,64.1 78.77,64.59 77.51,64.59 77.5,64.6 63.46,64.6 v63.16,64.3
  Bottom 0.152: IC1.34 59.16,59.3 63.16,63.3 v63.16,64.3
PA2  (via drill 0.35)
  Top 0.152: v32.56,41.8 32.56,43.4 31.66,44.3 23.36,44.3 21.96,42.9 21.96,41.3 21.46,40.8 U$2.2
  Bottom 0.152: IC1.35 56.56,59.7 56.26,59.4 56.26,55.7 47.76,47.2 41.06,47.2 40.26,46.4 40.26,44 39.96,43.7 37.46,43.7 36.66,44.5 36.06,44.5 35.06,43.5 35.06,42.7 34.16,41.8 v32.56,41.8
PA3  (via drill 0.35)
  Top 0.152: U$2.1 19.72,41.4 20.56,41.4 21.16,42 21.16,43.1 22.96,44.9 32.16,44.9 v33.88,43.18
  Bottom 0.152: IC1.36 57.59,60.07 57.56,60.1 56.36,60.1 55.86,59.6 55.86,55.9 47.56,47.6 40.26,47.6 38.66,46 36.56,46 33.88,43.32 v33.88,43.18
PA4  (via drill 0.35)
  Top 0.152: v24.06,39.2 23.76,39.5 U$2.4
  Bottom 0.152: IC1.37 57.59,60.53 57.56,60.5 56.06,60.5 55.46,59.9 55.46,56.1 47.36,48 40.06,48 38.76,46.7 36.16,46.7 | 36.16,46.7 36.14,46.7 | 36.16,46.7 28.96,39.5 24.46,39.5 24.16,39.2 v24.06,39.2
PA5  (via drill 0.35)
  Top 0.152: v24.06,40.5 23.71,40.15 U$2.3
  Bottom 0.152: IC1.38 55.86,60.9 55.06,60.1 55.06,56.4 47.06,48.4 39.76,48.4 38.46,47.1 35.46,47.1 28.56,40.2 24.36,40.2 v24.06,40.5
PB4  (via drill 0.35)
  Top 0.152: v52.96,59.3 53.36,59.7 56.66,59.7 58.16,58.2 63.56,58.2 64.26,58.9 64.26,61.2 66.36,63.3 69.16,63.3 70.46,62 v71.06,62
  Bottom 0.152: D3.C 52.17,59.3 v52.96,59.3 | v71.06,62 71.36,61.7 IC1.121
PB5  (via drill 0.35)
  Top 0.152: v71.06,63.1 70.06,63.1 69.46,63.7 66.06,63.7 63.76,61.4 63.76,59 63.36,58.6 58.46,58.6 55.26,61.8 v55.26,62
  Bottom 0.152: D2.C 50.39,67.27 55.26,62.4 v55.26,62 | v71.06,63.1 72.06,62.1 IC1.120
PC4
  Bottom 0.152: IC4.3 38.22,37.94 37.36,38.8 37.36,42.1 37.66,42.4 42.16,42.4 45.86,46.1 47.96,46.1 49.46,47.6 49.46,48.1 54.96,53.6 54.96,53.7 57.66,56.4 61.86,56.4 61.96,56.5 IC1.25
PC5
  Bottom 0.152: IC4.6 42.21,41.75 46.06,45.6 48.16,45.6 49.96,47.4 49.96,47.8 55.26,53.1 55.26,53.3 57.96,56 62.06,56 62.36,56.3 IC1.24
PC6
  Bottom 0.152: IC4.4 39.15,39.35 39.15,40.41 IC4.5 39.44,40.48 40.36,41.4 42.46,41.4 46.26,45.2 48.36,45.2 50.46,47.3 50.46,47.6 55.66,52.8 55.66,52.9 58.36,55.6 62.56,55.6 63.16,56.2 IC1.22 63.08,57.48 62.77,57.48 IC1.23
PD0  (via drill 0.35)
  Top 0.152: v75.46,57.4 79.76,53.1 v80.76,53.1 | R8.1 83.46,53.29 v83.46,52.5
  Bottom 0.152: 71.61,57.33 IC1.1 75.41,57.45 v75.46,57.4 | v80.76,53.1 82.86,53.1 v83.46,52.5 84.73,51.23 U$9.SDO
PD1  (via drill 0.35)
  Top 0.152: v76.56,57.4 76.56,57.1 79.26,54.4 v79.46,54.4
  Bottom 0.152: U$9.SDI 85.13,51.73 83.06,53.8 80.06,53.8 v79.46,54.4 | IC1.2 71.16,58.4 71.36,58.6 71.96,58.6 72.26,58.3 76.36,58.3 76.56,58.1 v76.56,57.4
PD2  (via drill 0.35)
  Top 0.152: v80.66,55.5 80.26,55.5 79.96,55.8 79.26,55.8 78.01,57.05 78.01,57.75 76.86,58.9 71.16,58.9 70.46,59.6 70.46,60 v70.36,60.1
  Bottom 0.152: U$9.N_SCS 85.83,52.73 83.06,55.5 v80.66,55.5 | IC1.3 70.76,59.2 70.36,59.6 v70.36,60.1
PD3  (via drill 0.35)
  Top 0.152: v80.76,54.5 80.46,54.5 79.56,55.4 78.96,55.4 77.56,56.8 77.56,57.5 76.66,58.4 70.56,58.4 v69.86,59
  Bottom 0.152: U$9.SCLK 85.43,52.23 83.16,54.5 v80.76,54.5 | IC1.4 70.36,58.5 v69.86,59
PD4  (via drill 0.35)
  Top 0.152: v74.56,60.5 75.26,61.2 85.66,61.2 86.26,61.8 86.26,65.49 U1.3 86.85,66.08 C35.1
  Bottom 0.152: 73.13,60.07 IC1.125 74.16,60.1 v74.56,60.5
PD5  (via drill 0.35)
  Top 0.152: v81.26,57.5 82.66,56.1 82.66,50.2 v83.06,49.8 83.26,49.6 85.16,49.6 85.76,50.2 85.95,50.2 86.3,50.55 | C38.1 86.3,50.55 | 86.3,50.55 86.04,50.2
  Bottom 0.152: IC1.126 79.56,59.7 80.36,58.9 80.36,58 80.86,57.5 v81.26,57.5 | U$9.SOA 83.13,49.73 v83.06,49.8
PD6  (via drill 0.35)
  Top 0.152: C39.1 86.05,49.2 84.36,49.2 84.06,48.9 v83.66,48.9 82.86,48.9 82.06,49.7 82.06,55.9 81.26,56.7 80.56,56.7 v79.86,57.4
  Bottom 0.152: 86.31,49.3 U$9.SOB 83.99,49.23 v83.66,48.9 | 73.13,59.31 IC1.127 79.16,59.3 79.56,58.9 79.56,57.7 v79.86,57.4
PD7  (via drill 0.35)
  Top 0.152: C40.1 86.25,48.4 v84.56,48.4 84.36,48.2 82.86,48.2 81.56,49.5 81.56,55.7 80.96,56.3 79.96,56.3 v78.86,57.4
  Bottom 0.152: 86.36,48.7 U$9.SOC 84.89,48.73 v84.56,48.4 | v78.86,57.4 79.06,57.6 79.06,58.6 78.76,58.9 IC1.128
PE0  (via drill 0.35)
  Top 0.152: v76.86,53.6 76.86,53.7 73.26,57.3 67.66,57.3 66.06,58.9 66.06,59.9 66.46,60.3 v66.46,60.6 | v82.66,43.4 82.81,43.25 U$1.6
  Bottom 0.152: IC1.15 65.96,59.1 66.16,59.3 66.16,60.3 v66.46,60.6 | v76.86,53.6 76.86,52.5 78.46,50.9 80.16,50.9 80.56,50.5 80.56,48.1 82.66,46 v82.66,43.4
PE1  (via drill 0.35)
  Top 0.152: v77.16,54.6 76.66,54.6 73.46,57.8 67.66,57.8 66.86,58.6 v66.86,59.4 | v83.36,42.2 83.81,41.75 U$1.5
  Bottom 0.152: IC1.14 66.36,58.9 v66.86,59.4 | v77.16,54.6 77.56,54.2 77.56,52.5 78.66,51.4 80.66,51.4 81.06,51 81.06,48.4 84.06,45.4 84.06,42.9 v83.36,42.2
PE2  (via drill 0.35)
  Top 0.152: v84.16,40.3 84.21,40.25 U$1.4
  Bottom 0.152: 66.73,57.48 IC1.13 66.76,56.3 67.06,56 68.76,56 69.66,55.1 72.76,55.1 72.96,55.3 77.56,55.3 78.16,54.7 78.16,52.7 78.96,51.9 81.36,51.9 81.56,51.7 81.56,48.8 85.16,45.2 85.16,41.3 v84.16,40.3
PE3  (via drill 0.35)
  Top 0.152: v85.56,38.7 87.21,38.7 U$1.3
  Bottom 0.152: 67.19,57.48 IC1.12 67.16,56.5 67.26,56.4 68.96,56.4 69.86,55.5 72.36,55.5 72.66,55.8 77.86,55.8 78.66,55 78.66,52.9 79.16,52.4 81.76,52.4 82.16,52 82.16,49 86.06,45.1 86.06,39.2 v85.56,38.7
PE5  (via drill 0.35)
  Top 0.152: v71.36,60.5 68.96,62.9 66.56,62.9 64.66,61 64.66,58.7 63.76,57.8 57.76,57.8 56.76,58.8 v54.16,58.8
  Bottom 0.152: 73.13,60.53 IC1.124 v71.36,60.5 | v54.16,58.8 53.96,58.6 50.76,58.6 50.56,58.8 50.56,60.5 50.04,61.03 IC3.7
PG0  (via drill 0.35)
  Top 0.152: v70.06,66.1 75.66,66.1 78.76,69.2 83.36,69.2 84.16,68.4 84.16,64.3 v84.36,64.1
  Bottom 0.152: IC1.49 59.26,65.3 60.06,66.1 v70.06,66.1 | v84.36,64.1 88.61,59.85 U$9.INHA
PJ0
  Bottom 0.152: 72.98,63.73 IC1.116
PK0
  Bottom 0.152: 64.75,57.33 IC1.18
PK1
  Bottom 0.152: IC1.19 64.36,56.8
PP0  (via drill 0.35)
  Top 0.152: v87.56,58.6 91.66,58.6 92.46,57.8 v92.66,57.8
  Bottom 0.152: IC1.118 76.46,62.9 78.06,61.3 80.46,61.3 81.96,59.8 85.66,59.8 86.86,58.6 v87.56,58.6 | 91.11,54.45 U$9.INLC 91.11,56.05 91.96,56.9 91.96,57.1 v92.66,57.8
PP1  (via drill 0.35)
  Top 0.152: v86.36,57.5 86.86,57 v91.06,57
  Bottom 0.152: IC1.119 76.36,62.5 77.96,60.9 80.26,60.9 81.86,59.3 85.26,59.3 86.36,58.2 v86.36,57.5 | v91.06,57 91.06,56.9 90.61,56.45 U$9.INHC
PQ0
  Bottom 0.152: U$9.CAL 86.41,53.95 83.66,56.7 72.26,56.7 71.86,56.3 70.06,56.3 69.96,56.4 IC1.5
PQ1
  Bottom 0.152: U$9.ENABLE 83.32,56.3 72.46,56.3 72.06,55.9 69.96,55.9 69.56,56.3 IC1.6
RBIAS
  Bottom 0.152: R24.2 56.45,69.09 56.66,69.3 IC1.59
SCK
  Bottom 0.152: D2.A 45.03,67.17 R33.2 IC3.5
SH1  (via drill 0.35)
  Top 0.152: U$12.2 24.45,34.48 v25.26,35.3
  Bottom 0.152: U$9.SHA 92.41,50.22 92.43,50.2 94.26,50.2 94.76,49.7 94.76,16 90.26,11.5 89.16,11.5 86.96,9.3 86.26,9.3 84.06,7.1 82.46,7.1 80.46,5.1 77.96,5.1 76.76,3.9 73.26,3.9 72.16,2.8 68.26,2.8 67.26,1.8 65.56,1.8 64.56,2.8 60.56,2.8 59.96,3.4 56.36,3.4 54.96,4.8 52.16,4.8 50.36,6.6 48.06,6.6 45.56,9.1 40.26,9.1 25.12,15.64 22.46,18.3 22.46,24.2 24.26,26 24.26,32.2 26.06,34 26.06,34.5 v25.26,35.3
SH2  (via drill 0.35)
  Top 0.152: v30.56,24 31.46,24 31.86,23.6 U$11.2
  Bottom 0.152: U$9.SHB 90.11,17.15 85.76,12.8 84.96,12.8 82.46,10.3 81.06,10.3 78.96,8.2 76.26,8.2 75.16,7.1 71.76,7.1 70.56,5.9 62.66,5.9 62.06,6.5 58.56,6.5 57.16,7.9 53.86,7.9 52.16,9.6 49.66,9.6 46.46,12.8 41.46,12.8 40.16,14.1 38.26,14.1 37.56,14.8 37.56,17.3 39.86,19.6 39.86,24.7 39.66,24.9 32.66,24.9 31.76,24 v30.56,24
SH3  (via drill 0.35)
  Top 0.152: U$10.2 50.24,15.9 48.46,15.9 v48.36,16
  Bottom 0.152: U$9.SHC 88.61,17.85 85.16,14.4 84.26,14.4 81.66,11.8 80.46,11.8 78.26,9.6 75.66,9.6 74.66,8.6 71.16,8.6 69.76,7.2 63.26,7.2 62.56,7.9 59.16,7.9 57.66,9.4 54.86,9.4 53.36,10.9 50.86,10.9 50.46,11.3 50.46,15.4 50.06,15.8 48.56,15.8 v48.36,16
SWCLK
  Bottom 0.152: J3.3 82.29,65.43 81.06,64.2 79.16,64.2 78.66,64.7 78.66,65.8 77.96,66.5 77.96,68 76.66,69.3 74.66,69.3 73.86,70.1 IC1.100
SWDIO
  Bottom 0.152: IC1.99 74.06,70.5 74.86,69.7 76.86,69.7 78.36,68.2 78.36,66.9 79.83,65.43 J3.4
SWO
  Bottom 0.152: IC1.97 74.26,71.3 75.06,70.5 77.46,70.5 J3.6
TDI
  Bottom 0.152: J3.5 81.26,66.7 79.16,66.7 78.76,67.1 78.76,68.4 77.06,70.1 74.96,70.1 74.16,70.9 IC1.98
VDDC  (via drill 0.35)
  Top 0.152: v68.56,71.2 v70.46,69.3
  Bottom 0.152: C21.1 67.93,74.46 C30.1 67.96,74.35 67.96,72.79 67.94,72.77 IC1.87 67.95,72.72 67.95,71.81 v68.56,71.2 | v68.56,71.2 | v70.46,69.3 | v70.46,69.3 71.15,68.61 71.15,65.26 71.61,64.8 71.61,64.34 71.85,64.1 IC1.115 73.86,64.1 74.36,63.6 75.16,63.6 C29.1
VREFA  (via drill 0.35)
  Top 0.152: R25.1 68.36,60.61 68.46,60.51 v68.46,59.5
  Bottom 0.152: IC1.9 68.36,58.3 68.46,58.4 v68.46,59.5
XOSC0
  Bottom 0.152: 59.52,72.85 IC1.66 59.56,73.6 59.06,74.1 57.55,74.1 C24.1 | 57.45,74.3 C24.1 | C24.1 55.52,72.88 X2.P$1
XOSC1
  Bottom 0.152: 58.93,74.83 C25.1 59.03,74.73 59.96,73.8 IC1.67 | IC1.67 59.96,72 | IC1.67 59.96,71.8 59.86,71.7 58.56,71.7 X2.P$2

## Text on the board
tPlace: NRST | SWO | TDI | SWDIO | SWCLK | PA0 | PA1 | AVOCADO V2.0 / WILDCAT ROBOT / DESIGN STUDIO | 5V | M3 | M2 | M1 | GND | 24V | ALLEN / AKASH / NATHAN / RACHEL / RYAN / TSONG / WEILIN
bPlace: NRST | TDI | SWO | SWCLK | SWDIO | PA1 | PA0